# EasyEDA Pro project Super Hub.epro

# Schematic Schematic1
Board Name: Board1; Create Date: 2026-07-24; Page Name: P1; Project Name: Usb hub; Schematic Name: Schematic1; Update Date: 2026-07-24; Company: EasyEDA.com; Page Size: A4; Version: V1.0
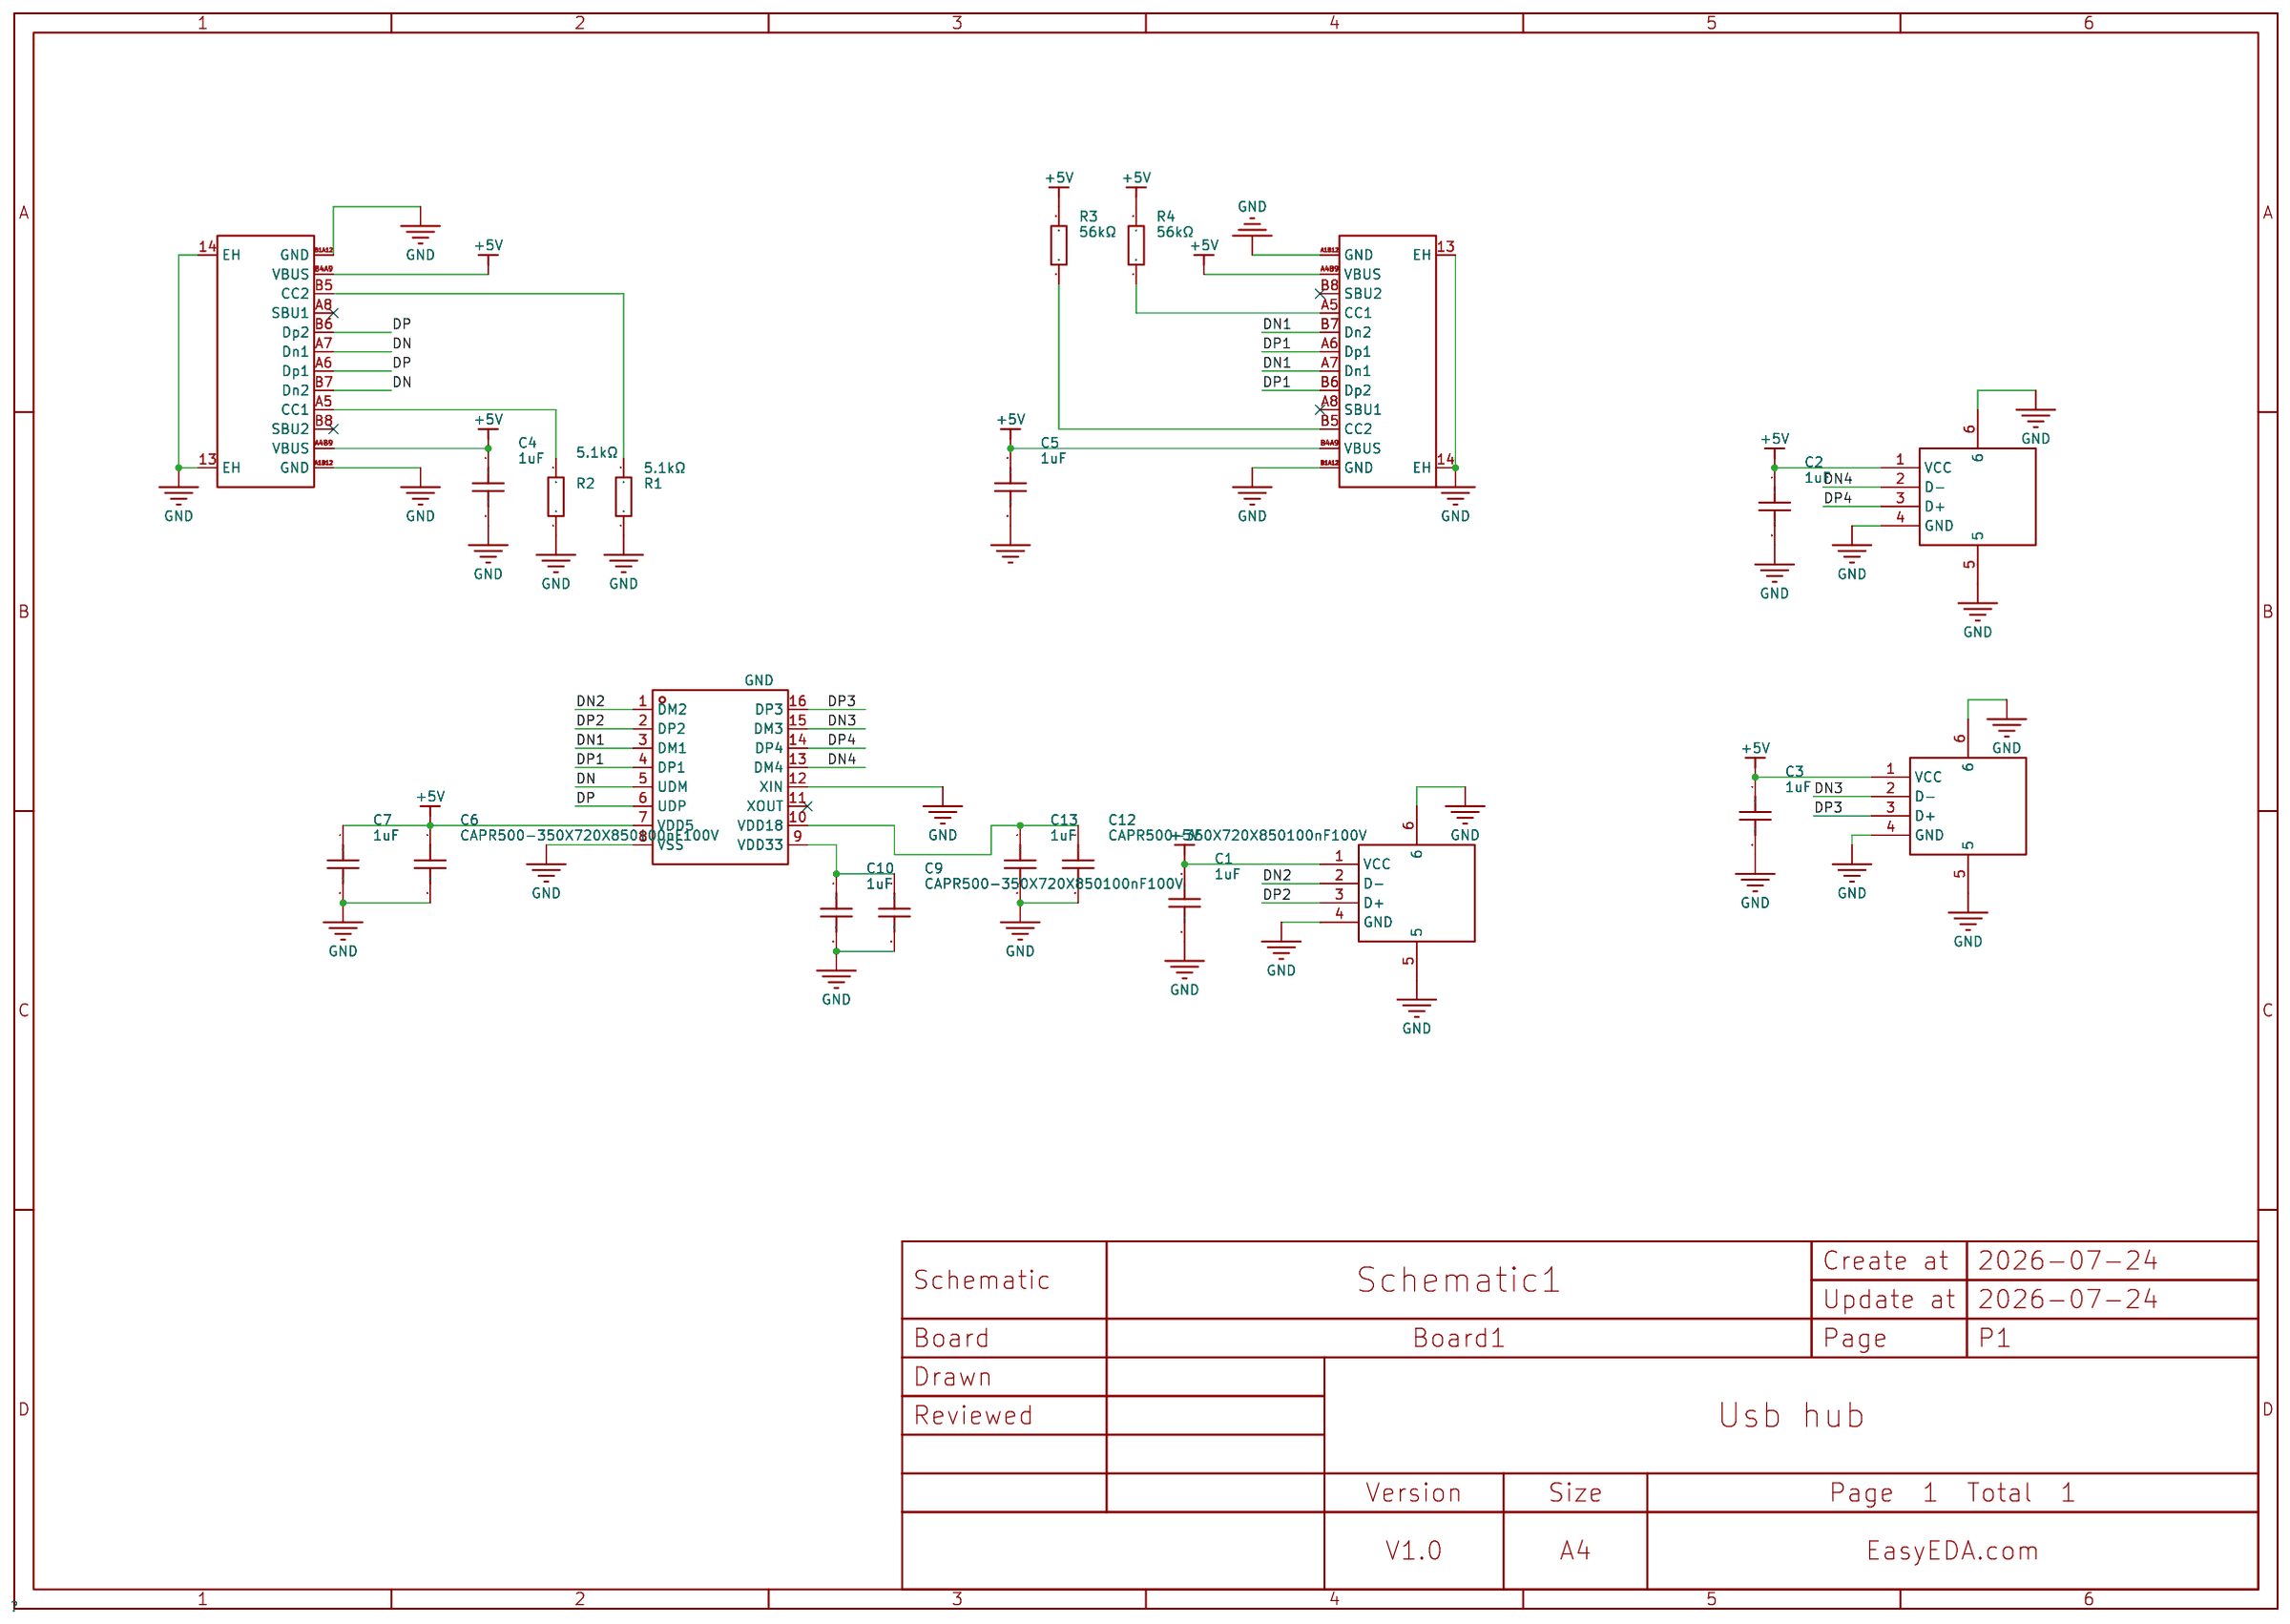
[diagram p0: schematic sheet]

## Parts
C1  1uF  [C0603]
C2  1uF  [C0603]
C3  1uF  [C0603]
C4  1uF  [C0603]
C5  1uF  [C0603]
C6  CAPR500-350X720X850100nF100V  [C0603]
C7  1uF  [C0603]
C9  CAPR500-350X720X850100nF100V  [C0603]
C10  1uF  [C0603]
C12  CAPR500-350X720X850100nF100V  [C0603]
C13  1uF  [C0603]
R1  5.1kΩ  [R0603]
R2  5.1kΩ  [R0603]
R3  56kΩ  [R0603]
R4  56kΩ  [R0603]
U1  SL2.1s  [SSOP-16_L4.6-W2.6-P0.53-LS4.0-BL]
USB1  10.0 QHHTZB6.3  [USB-A-TH_10.0QHHTZB6.3]
USB2  10.0 QHHTZB6.3  [USB-A-TH_10.0QHHTZB6.3]
USB3  10.0 QHHTZB6.3  [USB-A-TH_10.0QHHTZB6.3]
USB4  TYPE-C 16PIN 2MD(073)  [USB-C-SMD_TYPE-C-16PIN-2MD-073]
USB5  TYPE-C 16PIN 2MD(073)  [USB-C-SMD_TYPE-C-16PIN-2MD-073]

## Library data of the parts
C1-C5 C7 C10 C13 = CL10A105KB8NNNC: Capacitance:1uF Tolerance:±10% Tolerance:±10% Voltage Rating:50V Temperature Coefficient:X5R; LCSC Part Name: 1uF ±10% 50V; Supplier Part: C15849; Manufacturer: SAMSUNG(三星); Supplier Footprint: 0603; JLCPCB Part Class: Basic Part; Datasheet: https://item.szlcsc.com/datasheet/CL10A105KB8NNNC/16531.html; Supplier: LCSC; Tolerance: ±10%; Voltage Rating: 50V; Temperature Coefficient: X5R
C6 C9 C12 = CAPR500-350X720X850100nF100V: Supplier Part: C2927433; Supplier Footprint: CAP-TH; JLCPCB Part Class: Extended Part; Supplier: LCSC
R1 R2 = 0603WAF5101T5E: Type:Thick Film Resistor Resistance:5.1kΩ Tolerance:±1% Tolerance:±1% Power(Watts):100mW Voltage-Supply(Max):75V Temperature Coefficient:±100ppm/℃ Temperature Coefficient:±100ppm/℃ Operating Temperature:-55℃~+155℃ Operating Temperature:-55℃~+155℃; LCSC Part Name: 5.1kΩ ±1% 100mW 厚膜电阻; Supplier Part: C23186; Manufacturer: UNI-ROYAL(厚声); Supplier Footprint: 0603; JLCPCB Part Class: Basic Part; Datasheet: https://item.szlcsc.com/datasheet/0603WAF5101T5E/23913.html; Supplier: LCSC; Type: Thick Film Resistor; Tolerance: ±1%; Power(Watts): 100mW; Voltage-Supply(Max): 75V; Temperature Coefficient: ±100ppm/℃; Operating Temperature: -55℃~+155℃
R3 R4 = 0603WAF5602T5E: Type:Thick Film Resistor Resistance:56kΩ Tolerance:±1% Tolerance:±1% Power(Watts):100mW Voltage-Supply(Max):75V Temperature Coefficient:±100ppm/℃ Temperature Coefficient:±100ppm/℃ Operating Temperature:-55℃~+155℃ Operating Temperature:-55℃~+155℃; LCSC Part Name: 56kΩ ±1% 100mW 厚膜电阻; Supplier Part: C23206; Manufacturer: UNI-ROYAL(厚声); Supplier Footprint: 0603; JLCPCB Part Class: Basic Part; Datasheet: https://item.szlcsc.com/datasheet/0603WAF5602T5E/23933.html; Supplier: LCSC; Type: Thick Film Resistor; Tolerance: ±1%; Power(Watts): 100mW; Voltage-Supply(Max): 75V; Temperature Coefficient: ±100ppm/℃; Operating Temperature: -55℃~+155℃
U1 = SL2.1s: type:Hub USB Protocol:USB 2.0 Data Rate:- Voltage - Supply:4V~5.25V Voltage - Supply:4V~5.25V Operating Temperature:0℃~+70℃ Operating Temperature:0℃~+70℃ Memory Interface:- Current - Supply:120mA Quiescent Supply Current:2.5mA Number of Channels:4; LCSC Part Name: USB2.0 HUB控制器集成电路; Supplier Part: C2684433; Manufacturer: CoreChips(和芯润德); Supplier Footprint: SSOP-16; JLCPCB Part Class: Extended Part; Datasheet: https://item.szlcsc.com/datasheet/SL2.1s/2782346.html; Supplier: LCSC; type: Hub; USB Protocol: USB 2.0; Voltage - Supply: 4V~5.25V; Operating Temperature: 0℃~+70℃; Current - Supply: 120mA; Quiescent Supply Current: 2.5mA; Number of Channels: 4
USB1-USB3 = 10.0 QHHTZB6.3: Connector Type:Type-A Protocol Standard:USB 2.0 Gender:Female Mounting Type:Surface Mount, Right Angle Number of Contacts:4P Number of Ports:1 Current Rating-Power:1.5A Voltage Rating:30V Connect-Disconnect Life:5,000 times Supplementary Features:- Center; LCSC Part Name: 壳长10.0mm; Supplier Part: C668591; Manufacturer: SHOU HAN(首韩); Supplier Footprint: SMD; JLCPCB Part Class: Extended Part; Datasheet: https://item.szlcsc.com/datasheet/10.0%2520QHHTZB6.3/698534.html; Supplier: LCSC; Connector Type: Type-A; Protocol Standard: USB 2.0; Gender: Female; Mounting Type: Surface Mount, Right Angle; Number of Contacts: 4P; Number of Ports: 1; Current Rating-Power: 1.5A; Voltage Rating: 30V; Connect-Disconnect Life: 5,000 times; Length: 10mm; Detection color: Black; Operating Temperature: -25℃~+85℃
USB4 USB5 = TYPE-C 16PIN 2MD(073): Connector Type:Type-C Protocol Standard:- Gender:Female Mounting Type:Surface Mount, Right Angle Number of Contacts:16P Number of Ports:1 Current Rating-Power:3A Voltage Rating:5V Connect-Disconnect Life:10,000 cycles Supplementary Features:- Center Heigh; LCSC Part Name: Type-C 母 卧贴; Supplier Part: C2765186; Manufacturer: SHOU HAN(首韩); Supplier Footprint: SMD; JLCPCB Part Class: Extended Part; Datasheet: https://item.szlcsc.com/datasheet/TYPE-C%252016PIN%25202MD(073)/2901843.html; Supplier: LCSC; Connector Type: Type-C; Gender: Female; Mounting Type: Surface Mount, Right Angle; Number of Contacts: 16P; Number of Ports: 1; Current Rating-Power: 3A; Voltage Rating: 5V; Connect-Disconnect Life: 10,000 cycles; Detection color: Black; Operating Temperature: -25℃~+85℃

## Nets
+5V: C1.1 C2.1 C3.1 C4.1 C5.1 C6.1 C7.1 R3.2 R4.2 U1.7(VDD5) USB1.1(VCC) USB2.1(VCC) USB3.1(VCC) USB4.A4B9(VBUS) USB4.B4A9(VBUS) USB5.A4B9(VBUS) USB5.B4A9(VBUS)
GND: C1.2 C2.2 C3.2 C4.2 C5.2 C6.2 C7.2 C9.2 C10.2 C12.2 C13.2 R1.1 R2.1 U1.8(VSS) U1.12(XIN) USB1.4(GND) USB1.5 USB1.6 USB2.4(GND) USB2.5 USB2.6 USB3.4(GND) USB3.5 USB3.6 USB4.13(EH) USB4.14(EH) USB4.A1B12(GND) USB4.B1A12(GND) USB5.13(EH) USB5.14(EH) USB5.A1B12(GND) USB5.B1A12(GND)
DN: U1.5(UDM) USB5.A7(Dn1) USB5.B7(Dn2)
DN1: U1.3(DM1) USB4.A7(Dn1) USB4.B7(Dn2)
DN2: U1.1(DM2) USB3.2(D-)
DN3: U1.15(DM3) USB2.2(D-)
DN4: U1.13(DM4) USB1.2(D-)
DP: U1.6(UDP) USB5.A6(Dp1) USB5.B6(Dp2)
DP1: U1.4(DP1) USB4.A6(Dp1) USB4.B6(Dp2)
DP2: U1.2(DP2) USB3.3(D+)
DP3: U1.16(DP3) USB2.3(D+)
DP4: U1.14(DP4) USB1.3(D+)
$1N8: R2.2 USB5.A5(CC1)
$1N9: R1.2 USB5.B5(CC2)
$1N46: R4.1 USB4.A5(CC1)
$1N47: R3.1 USB4.B5(CC2)
$1N82: C9.1 C10.1 U1.9(VDD33)
$1N87: C12.1 C13.1 U1.10(VDD18)

Not connected (* = marked no-connect by the designer): U1 11(XOUT)*; USB4 A8(SBU1)* B8(SBU2)*; USB5 A8(SBU1)* B8(SBU2)*

# Board PCB1
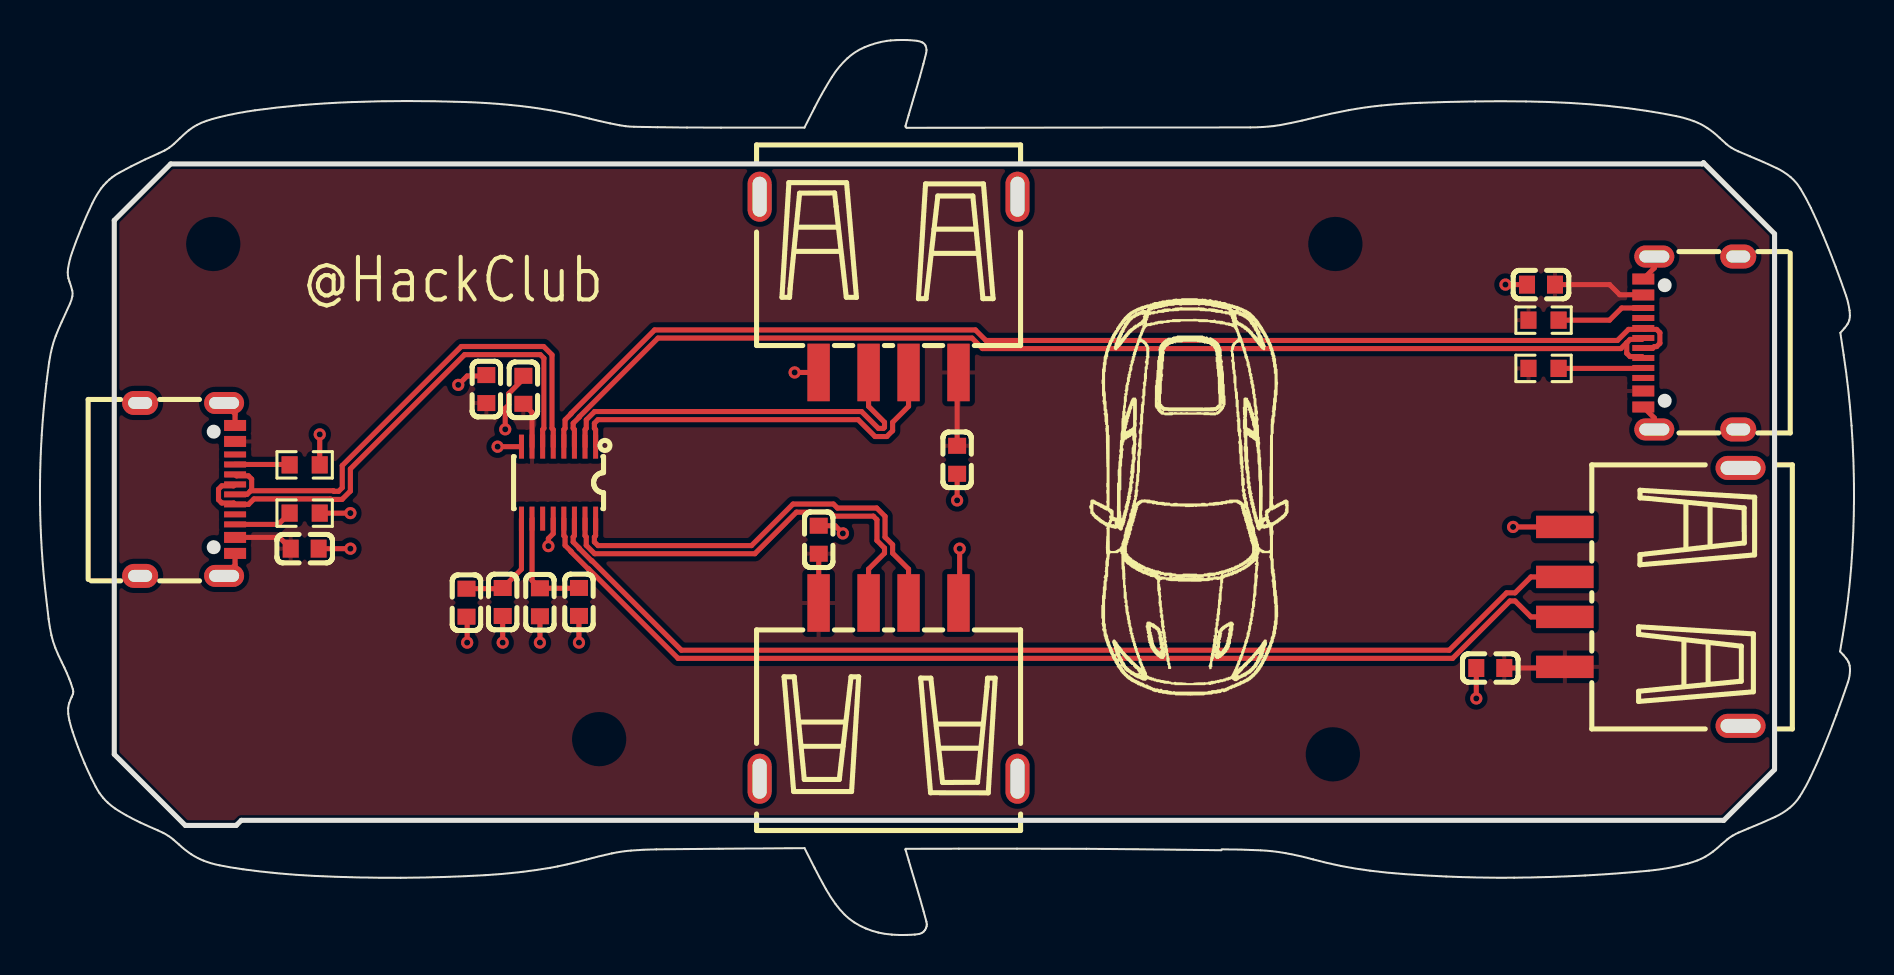
[diagram p1: board, top side]
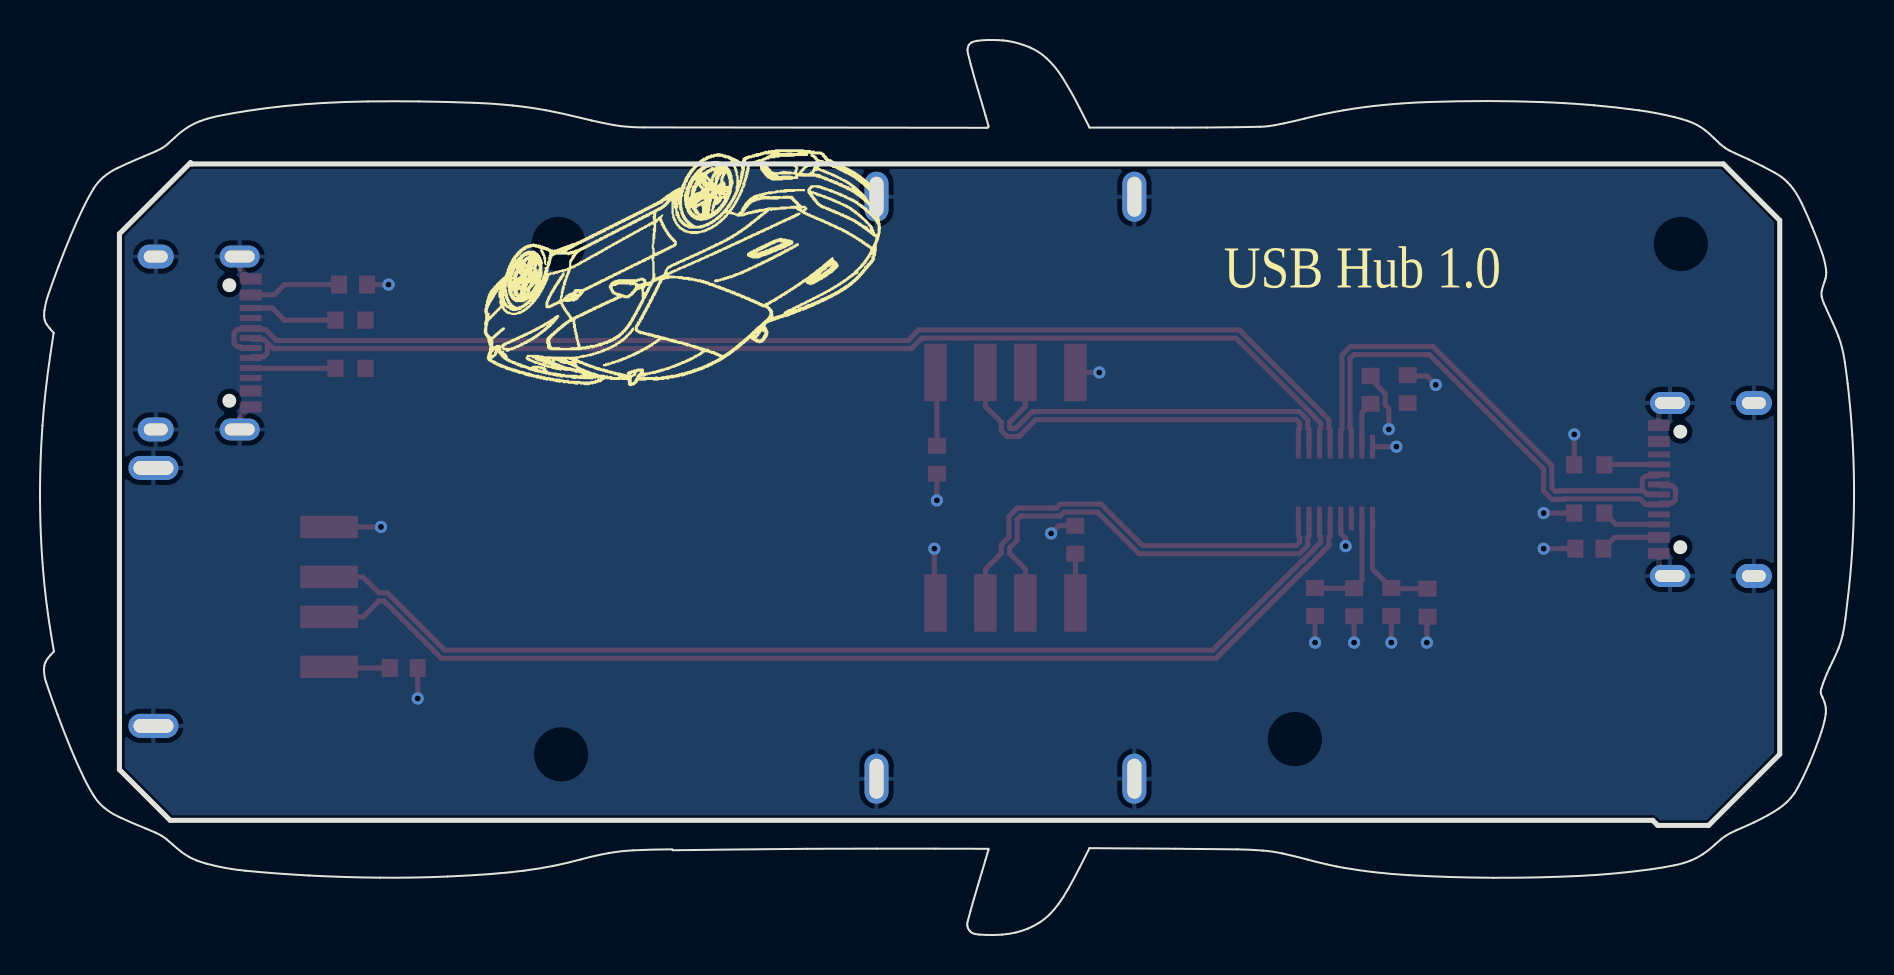
[diagram p2: board, bottom side, seen from below]

Outline 90.75 x 44.77 mm; copper layers: Top Layer, Bottom Layer. Coordinates in mm from the lower left corner of the outline.
Outline path: 0,22.44 arc(0.03,23.72) 0.09,25 arc(0.19,26.29) 0.32,27.57 arc(0.39,28.12) 0.46,28.66 arc(0.52,29.02) 0.6,29.36 arc(0.69,29.66) 0.79,29.96 arc(0.93,30.31) 1.08,30.65 arc(1.3,31.12) 1.51,31.59 arc(1.57,31.76) 1.62,31.94 arc(1.63,32.09) 1.61,32.24 arc(1.55,32.46) 1.48,32.68 arc(1.45,32.76) 1.43,32.84 arc(1.41,32.92) 1.4,33 arc(1.39,33.08) 1.39,33.15 arc(1.4,33.23) 1.41,33.31 arc(1.49,33.73) 1.61,34.13 arc(1.83,34.76) 2.08,35.37 arc(2.34,35.98) 2.62,36.59 arc(2.82,36.98) 3.06,37.35 arc(3.12,37.42) 3.18,37.49 arc(3.25,37.56) 3.32,37.64 arc(3.4,37.72) 3.47,37.79 arc(3.54,37.85) 3.61,37.9 arc(3.79,38.02) 3.97,38.13 arc(4.27,38.29) 4.57,38.45 arc(4.92,38.62) 5.26,38.79 arc(5.6,38.95) 5.94,39.1 arc(6.09,39.16) 6.23,39.24 arc(6.36,39.31) 6.47,39.38 arc(6.59,39.47) 6.71,39.57 arc(6.85,39.71) 7,39.85 arc(7.21,40.05) 7.44,40.24 arc(7.64,40.39) 7.86,40.52 arc(8.09,40.63) 8.34,40.72 arc(8.67,40.83) 8.99,40.91 arc(9.88,41.1) 10.77,41.25 arc(11.89,41.39) 13.01,41.5 arc(14.29,41.6) 15.58,41.66 arc(16.96,41.7) 18.35,41.71 arc(19.78,41.7) 21.22,41.67 arc(22.38,41.61) 23.53,41.52 arc(24.53,41.4) 25.54,41.25 arc(26.51,41.06) 27.48,40.84 arc(27.74,40.78) 27.99,40.71 arc(28.26,40.65) 28.52,40.6 arc(28.76,40.55) 28.99,40.5 arc(29.14,40.48) 29.3,40.46 arc(29.51,40.44) 29.72,40.43 arc(30.31,40.41) 30.91,40.4 arc(31.64,40.4) 32.37,40.39 arc(33.22,40.39) 34.07,40.38 38.25,40.38 38.75,41.38 arc(39.17,42.16) 39.62,42.92 arc(39.98,43.41) 40.39,43.85 arc(40.8,44.16) 41.25,44.41 arc(41.8,44.6) 42.36,44.72 arc(42.46,44.73) 42.56,44.74 arc(42.7,44.75) 42.83,44.76 arc(42.98,44.77) 43.12,44.77 arc(43.26,44.77) 43.39,44.76 arc(43.63,44.75) 43.87,44.73 arc(44.02,44.7) 44.15,44.64 arc(44.24,44.58) 44.3,44.49 arc(44.34,44.38) 44.35,44.26 arc(44.35,44.18) 44.33,44.1 arc(44.26,43.84) 44.2,43.57 arc(44.11,43.26) 44.03,42.95 arc(43.93,42.61) 43.83,42.26 arc(43.73,41.92) 43.62,41.58 arc(43.54,41.29) 43.46,41 arc(43.38,40.75) 43.31,40.49 arc(43.3,40.47) 43.3,40.44 arc(43.32,40.4) 43.37,40.38 60.55,40.4 arc(61.13,40.41) 61.7,40.46 arc(61.87,40.48) 62.05,40.51 arc(62.31,40.56) 62.57,40.61 arc(62.86,40.67) 63.15,40.74 arc(63.43,40.8) 63.71,40.87 arc(64.58,41.08) 65.46,41.26 arc(66.28,41.39) 67.11,41.49 arc(68.08,41.57) 69.05,41.63 arc(70.42,41.67) 71.8,41.69 arc(73.07,41.7) 74.35,41.69 arc(75.44,41.67) 76.53,41.62 arc(77.52,41.55) 78.51,41.46 arc(79.46,41.35) 80.4,41.22 arc(81.12,41.1) 81.84,40.96 arc(82.3,40.85) 82.74,40.71 arc(83.08,40.56) 83.41,40.37 arc(83.73,40.13) 84.03,39.87 arc(84.2,39.71) 84.37,39.56 arc(84.5,39.46) 84.63,39.37 arc(84.79,39.28) 84.95,39.2 arc(85.25,39.07) 85.55,38.95 arc(86.22,38.66) 86.88,38.36 arc(87.24,38.16) 87.58,37.91 arc(87.84,37.65) 88.06,37.34 arc(88.34,36.87) 88.59,36.37 arc(88.91,35.69) 89.21,35 arc(89.52,34.22) 89.83,33.44 arc(90.09,32.72) 90.35,31.99 arc(90.46,31.62) 90.53,31.24 arc(90.54,31.11) 90.55,30.97 arc(90.54,30.86) 90.51,30.75 arc(90.48,30.65) 90.43,30.56 arc(90.35,30.45) 90.27,30.35 90.07,30.12 90.24,29 arc(90.47,27.25) 90.63,25.48 arc(90.72,23.69) 90.75,21.89 arc(90.71,20.12) 90.61,18.36 arc(90.44,16.68) 90.19,15.02 90.05,14.18 90.22,14 arc(90.3,13.91) 90.38,13.82 arc(90.43,13.73) 90.48,13.64 arc(90.51,13.56) 90.53,13.47 arc(90.55,13.37) 90.55,13.27 arc(90.52,12.95) 90.45,12.64 arc(90.16,11.82) 89.87,11.01 arc(89.54,10.15) 89.2,9.29 arc(88.88,8.56) 88.55,7.84 arc(88.3,7.38) 88.03,6.92 arc(87.81,6.62) 87.53,6.36 arc(87.19,6.12) 86.82,5.92 arc(86.14,5.61) 85.46,5.33 arc(85.22,5.23) 84.98,5.12 arc(84.82,5.05) 84.67,4.97 arc(84.54,4.88) 84.42,4.79 arc(84.27,4.67) 84.12,4.54 arc(83.92,4.35) 83.7,4.18 arc(83.52,4.04) 83.32,3.92 arc(83.12,3.82) 82.91,3.73 arc(82.67,3.64) 82.43,3.57 arc(81.47,3.35) 80.49,3.22 arc(78.9,3.08) 77.31,2.98 arc(75.53,2.9) 73.75,2.87 arc(72.05,2.88) 70.36,2.93 arc(69.29,2.98) 68.23,3.05 arc(67.38,3.12) 66.54,3.22 arc(65.81,3.32) 65.09,3.45 arc(64.39,3.61) 63.7,3.78 arc(63.01,3.95) 62.31,4.1 arc(61.69,4.19) 61.07,4.24 arc(60.09,4.27) 59.11,4.29 arc(27.32,1384.8) 52.35,4.31 arc(50.61,4.32) 48.88,4.32 arc(47.42,4.32) 45.96,4.32 43.32,4.31 arc(43.31,4.31) 43.3,4.29 arc(43.3,4.28) 43.31,4.26 arc(43.38,4) 43.46,3.74 arc(43.54,3.46) 43.63,3.17 arc(43.73,2.83) 43.83,2.49 arc(43.93,2.14) 44.03,1.8 arc(44.12,1.49) 44.21,1.19 arc(44.28,0.93) 44.35,0.67 arc(44.36,0.6) 44.37,0.53 arc(44.36,0.49) 44.36,0.44 arc(44.35,0.39) 44.33,0.35 arc(44.31,0.3) 44.28,0.26 arc(44.25,0.22) 44.22,0.18 arc(44.17,0.14) 44.11,0.1 arc(44.04,0.07) 43.98,0.05 arc(43.88,0.03) 43.77,0.02 arc(43.59,0.01) 43.4,0 arc(43.01,0) 42.62,0.02 arc(42.28,0.06) 41.94,0.13 arc(41.62,0.21) 41.32,0.33 arc(41.02,0.47) 40.75,0.63 arc(40.49,0.81) 40.25,1.02 arc(40.02,1.28) 39.8,1.55 arc(39.55,1.92) 39.32,2.29 arc(39.03,2.83) 38.74,3.38 38.25,4.35 33.97,4.32 arc(32.4,4.3) 30.84,4.28 arc(30.2,4.27) 29.57,4.22 arc(29.09,4.17) 28.61,4.08 arc(27.97,3.94) 27.34,3.77 arc(27.12,3.71) 26.89,3.66 arc(26.64,3.6) 26.39,3.54 arc(26.14,3.48) 25.9,3.43 arc(25.71,3.39) 25.52,3.36 arc(23.9,3.13) 22.27,2.99 arc(20.16,2.9) 18.05,2.86 arc(15.9,2.88) 13.74,2.96 arc(11.94,3.08) 10.15,3.29 arc(9.57,3.38) 8.98,3.49 arc(8.58,3.59) 8.19,3.72 arc(7.87,3.86) 7.57,4.04 arc(7.25,4.28) 6.95,4.53 arc(6.82,4.65) 6.68,4.77 arc(6.56,4.87) 6.43,4.95 arc(6.31,5.03) 6.18,5.1 arc(6.04,5.17) 5.89,5.24 arc(5.45,5.43) 5.02,5.63 arc(4.67,5.8) 4.32,5.99 arc(4.04,6.15) 3.77,6.32 arc(3.57,6.47) 3.39,6.63 arc(3.27,6.75) 3.16,6.87 arc(3.06,6.98) 2.98,7.11 arc(2.88,7.26) 2.8,7.41 arc(2.68,7.64) 2.57,7.86 arc(2.39,8.23) 2.23,8.6 arc(2.07,8.99) 1.91,9.4 arc(1.77,9.77) 1.64,10.15 arc(1.55,10.44) 1.47,10.74 arc(1.44,10.9) 1.42,11.07 arc(1.41,11.21) 1.42,11.35 arc(1.44,11.48) 1.47,11.61 arc(1.52,11.76) 1.58,11.89 arc(1.62,11.97) 1.65,12.05 arc(1.66,12.11) 1.67,12.17 arc(1.66,12.24) 1.64,12.31 arc(1.6,12.45) 1.55,12.59 arc(1.51,12.7) 1.47,12.81 arc(1.41,12.95) 1.35,13.09 arc(1.29,13.24) 1.22,13.38 arc(1.16,13.51) 1.09,13.64 arc(0.92,14) 0.77,14.36 arc(0.66,14.67) 0.58,14.99 arc(0.5,15.4) 0.43,15.81 arc(0.34,16.58) 0.26,17.35 arc(0.14,18.62) 0.06,19.89 arc(0.01,21.16) 0,22.44 ; 3.72,35.75 6.54,38.57 83.16,38.57 83.22,38.63 86.78,35.07 86.78,8.28 84.24,5.74 10.07,5.74 9.82,5.48 7.28,5.48 3.72,9.04 3.72,35.75
Stack: Top Layer 0.035mm / Dielectric1 1.51mm FR4 er 4.5 / Bottom Layer 0.035mm

## Design rules (mm)
net DN2: DP3
net DP2: DP3
net DN1: DP2
net DP1: DP2
net DN: DP1
net DP: DP1
net DN4: DP5
net DP4: DP5
net DN3: DP4
net DP3: DP4
spacing copperThickness1oz (default): track to track 0.102, other pairs 0.152 to 0.3
spacing copperThickness2oz: track to track 0.203, other pairs 0.152 to 0.3
track width copperThickness1oz (default): min 0.127, default 0.254, max 2.54
track width copperThickness2oz: min 0.203, default 0.254, max 2.54
differential pair differentialPair (default): width min 0.127, default 0.254, max 2.54; gap min 0.152, default 0.152

## Placement (name value [footprint] x y rotation side)
C1  1uF  [C0603]  45.88 23.77 270 top
C2  1uF  [C0603]  72.55 13.36 180 top
C3  1uF  [C0603]  38.96 19.77 90 top
C4  1uF  [C0603]  13.24 19.33 0 top
C5  1uF  [C0603]  75.09 32.53 180 top
C6  CAPR500-350X720X850100nF100V  [C0603]  24.18 27.27 90 top
C7  1uF  [C0603]  22.33 27.31 90 top
C9  CAPR500-350X720X850100nF100V  [C0603]  23.15 16.66 270 top
C10  1uF  [C0603]  21.34 16.62 270 top
C12  CAPR500-350X720X850100nF100V  [C0603]  25.01 16.64 270 top
C13  1uF  [C0603]  26.96 16.66 270 top
R1  5.1kΩ  [R0603]  13.24 21.1 180 top
R2  5.1kΩ  [R0603]  13.24 23.52 180 top
R3  56kΩ  [R0603]  75.22 30.76 180 top
R4  56kΩ  [R0603]  75.22 28.34 180 top
U1  SL2.1s  [SSOP-16_L4.6-W2.6-P0.53-LS4.0-BL]  25.94 22.63 180 top
USB1  10.0 QHHTZB6.3  [USB-A-TH_10.0QHHTZB6.3]  80.68 16.91 90 top
USB2  10.0 QHHTZB6.3  [USB-A-TH_10.0QHHTZB6.3]  42.45 12.21 0 top
USB3  10.0 QHHTZB6.3  [USB-A-TH_10.0QHHTZB6.3]  42.45 32.53 180 top
USB4  TYPE-C 16PIN 2MD(073)  [USB-C-SMD_TYPE-C-16PIN-2MD-073]  82.58 29.61 90 top
USB5  TYPE-C 16PIN 2MD(073)  [USB-C-SMD_TYPE-C-16PIN-2MD-073]  7.39 22.29 270 top

## Footprints (pads in the part's own frame, mm; a bottom-side part is the same pattern mirrored in y, then rotated)
C0603
  rect 0.8x0.9 smd: 1(-0.7,0) 2(0.7,0)
R0603
  rect 0.806x0.864 smd: 1(-0.753,0) 2(0.753,0)
SSOP-16_L4.6-W2.6-P0.53-LS4.0-BL
  rect 0.25x1.2 smd: 1(-1.855,-1.8) 2(-1.325,-1.8) 3(-0.795,-1.8) 4(-0.265,-1.8) 5(0.265,-1.8) 6(0.795,-1.8) 7(1.325,-1.8) 8(1.855,-1.8) 9(1.855,1.8) 10(1.325,1.8) 11(0.795,1.8) 12(0.265,1.8) 13(-0.265,1.8) 14(-0.795,1.8) 15(-1.325,1.8) 16(-1.855,1.8)
USB-A-TH_10.0QHHTZB6.3
  rect 1.12x2.88 smd: 1(-3.5,4.395) 2(-1,4.395) 3(1,4.395) 4(3.5,4.395)
  oval 1.2x2.5 hole 0.7x2: 5(-6.45,-4.395) 6(6.45,-4.395)
USB-C-SMD_TYPE-C-16PIN-2MD-073
  oval 1.1x2 hole 0.6x1.5: 13(-4.325,1.825) 14(4.325,1.825)
  oval 1.2x1.8 hole 0.6x1.2: 13(-4.325,-2.375) 14(4.325,-2.375)
  rect 0.55x1.1 smd: A1B12(-3.2,2.375) A4B9(-2.4,2.375) B1A12(3.2,2.375) B4A9(2.4,2.375)
  rect 0.3x1.1 smd: A5(-1.25,2.375) A6(-0.25,2.375) A7(0.25,2.375) A8(1.25,2.375) B5(1.75,2.375) B6(0.75,2.375) B7(-0.75,2.375) B8(-1.75,2.375)

## Nets
As in the schematic.

Pads without a net: U1 11; USB4 A8 B8; USB5 A8 B8

## Via types
v1: diameter 0.61, hole 0.305, Top Layer to Bottom Layer, 18 vias

## Routing (per net, layer and track width the routed paths; a pad name or vN(x,y) marks a point on that pad's centre or on a via; arc(x,y) is an arc through that point)
+5V: length 19.2
  Top Layer w0.254: U1.7 24.62,26.14 C6.1 ; USB2.1 38.96,16.61 C3.1 ; C1.1 45.88,28.07 USB3.1 ; USB1.1 76.23,13.35 C2.1 ; C4.1 11.98,19.89 USB5.B4A9 ; C5.1 78.52,32.53 79.03,32.02 80.2,32.02 USB4.B4A9
GND: length 34.5
  Top Layer w0.254: R2.1 v1(14,25.04) ; USB1.4 v1(73.69,20.41) ; C1.2 v1(45.88,21.74) ; 9.76,19.09 9.76,18.51 USB5.14 ; U1.12 25.68,20.07 25.43,19.83 v1(25.43,19.45) ; C4.2 v1(15.53,19.32) ; USB4.B1A12 80.76,33.36 80.76,33.94 ; USB3.4 v1(37.75,28.14) ; 22.33,28.01 22.28,27.96 21.37,27.96 v1(20.93,27.52) ; USB5.A1B12 9.76,26.06 USB5.13 ; R1.1 v1(15.53,21.1) ; C5.2 v1(73.31,32.53) ; U1.8 v1(22.89,24.43) ; USB4.A1B12 80.76,25.86 USB4.13 ; C10.2 21.37,15.89 v1(21.37,14.62) ; USB2.4 46.01,16.66 v1(46.01,19.32) ; C9.2 v1(23.15,14.62) ; C2.2 v1(71.85,11.83) ; v1(40.17,20.09) 39.78,20.47 C3.2 ; v1(23.27,25.29) 23.27,26.34 23.45,26.52 23.45,27.08 24.18,27.81 C6.2 ; C12.2 v1(25.01,14.62) ; C13.2 v1(26.96,14.62)
DN: length 25.9
  Top Layer w0.254: 10.54,22.22 14.68,22.22 14.71,22.19 14.94,22.19 15.12,22.37 15.12,23.48 21.07,29.43 25.2,29.43 25.61,29.02 25.61,25.34 25.68,25.28 U1.5 ; 10.54,22.22 10.36,22.04 USB5.A7 ; 10.54,22.22 10.59,22.27 10.59,22.8 10.43,22.97 9.83,22.97 USB5.B7
DN1: length 58.4
  Top Layer w0.254: USB4.B7 80.14,28.93 79.54,28.93 79.38,29.1 79.38,29.63 ; 79.38,29.63 79.54,29.79 80.14,29.79 USB4.A7 ; 79.38,29.63 79.08,29.33 47.15,29.33 46.63,29.86 30.92,29.86 26.97,25.91 26.97,25.89 26.67,25.6 26.67,25.34 26.74,25.28 U1.3
DN2: length 19.9
  Top Layer w0.254: USB3.2 43.45,26.44 42.66,25.65 42.66,25.23 42.36,24.93 41.77,24.93 40.93,25.78 27.91,25.78 27.74,25.6 27.74,25.34 27.8,25.28 U1.1
DN3: length 21.7
  Top Layer w0.254: USB2.2 41.45,18.3 42.25,19.1 42.25,19.35 41.87,19.73 41.87,20.77 41.69,20.95 39.72,20.95 39.52,21.15 37.84,21.15 35.76,19.07 27.75,19.07 27.33,19.49 27.33,19.91 27.27,19.97 U1.15
DN4: length 55.2
  Top Layer w0.254: USB1.2 74.59,15.91 73.79,16.71 73.54,16.71 70.67,13.84 31.92,13.84 27.45,18.31 27.43,18.31 26.57,19.17 26.57,19.19 26.27,19.49 26.27,19.91 26.21,19.97 U1.13
DP: length 26.1
  Top Layer w0.254: 9.76,22.54 9.69,22.46 9.09,22.46 8.93,22.3 8.93,21.77 9.09,21.61 9.69,21.61 9.76,21.54 10.43,21.54 10.71,21.81 14.51,21.81 14.54,21.79 15.11,21.79 15.53,22.2 15.53,23.31 21.24,29.03 25.03,29.03 25.21,28.85 25.21,25.34 25.15,25.28 U1.6
DP1: length 60.1
  Top Layer w0.254: 80.28,30.29 79.47,30.29 78.92,29.74 47.32,29.74 46.8,30.26 30.75,30.26 26.57,26.08 26.57,26.06 26.27,25.77 26.27,25.34 26.21,25.28 U1.4 ; 80.28,30.29 80.87,30.29 81.04,30.13 81.04,29.6 80.87,29.43 80.76,29.43 80.71,29.38 80.23,29.38 USB4.A6 ; 80.28,30.29 USB4.B6
DP2: length 19.9
  Top Layer w0.254: U1.2 27.27,25.28 27.33,25.34 27.33,25.76 27.75,26.18 41.1,26.18 41.94,25.34 42.2,25.34 42.25,25.39 42.25,25.65 41.45,26.44 USB3.3
DP3: length 21.7
  Top Layer w0.254: USB2.3 43.45,18.3 42.66,19.1 42.66,19.52 42.28,19.9 42.28,20.94 41.86,21.36 39.89,21.36 39.69,21.56 37.67,21.56 35.59,19.48 27.91,19.48 27.74,19.66 27.74,19.91 27.8,19.97 U1.16
DP4: length 54.6
  Top Layer w0.254: USB1.3 74.59,17.91 73.79,17.12 73.37,17.12 70.5,14.25 32.09,14.25 27.62,18.72 27.6,18.72 26.97,19.34 26.97,19.36 26.68,19.66 26.68,19.91 26.74,19.97 U1.14
$1N8: length 2.7
  Top Layer w0.254: USB5.A5 12.47,23.54 R2.2
$1N9: length 3
  Top Layer w0.254: R1.2 11.92,20.54 USB5.B5
$1N46: length 4.2
  Top Layer w0.254: R4.1 80.19,28.34 USB4.A5
$1N47: length 4.5
  Top Layer w0.254: USB4.B5 79.13,31.36 78.52,30.75 R3.1
$1N82: length 5.7
  Top Layer w0.254: C10.1 23.11,17.32 C9.1 24.09,18.3 U1.9
$1N87: length 5.6
  Top Layer w0.254: C13.1 26.95,17.34 C12.1 24.62,17.74 U1.10

## Copper pours and planes (outline as drawn; the poured copper is in the pictures)
+5V on Top Layer: 3.96,38.53 87.16,38.53 87.16,5.48 3.96,5.48
GND on Bottom Layer: 4.01,38.62 86.87,38.62 86.87,5.05 4.01,5.05

## Text on the board
Bottom Silkscreen Layer: USB Hub 1.0
Top Silkscreen Layer: @HackClub
